# Altium schematic sheet EEM_DIOT_connector.SchDoc: Stabilizer
size 420 x 297 mm; Author: G.Kasprowicz; CompanyName: WUT ISE; DrawnBy: G.Kasprowicz; Organization: WUT ISE; Address1: PW ISE; Address2: Nowowiejska 15/19 00-665 Warsaw; Address3: gkasprow@gmail.com; DocumentNumber: 7; Revision: 1.0; SheetNumber: 7; SheetTotal: 9; ModifiedBy: -; CheckedDate: -; Title2: EEM connector & drivers; DivGrp: WUT ISE; Designer: G.Kasprowicz; ModifiedDate: -; ProjectName: Sensor Box
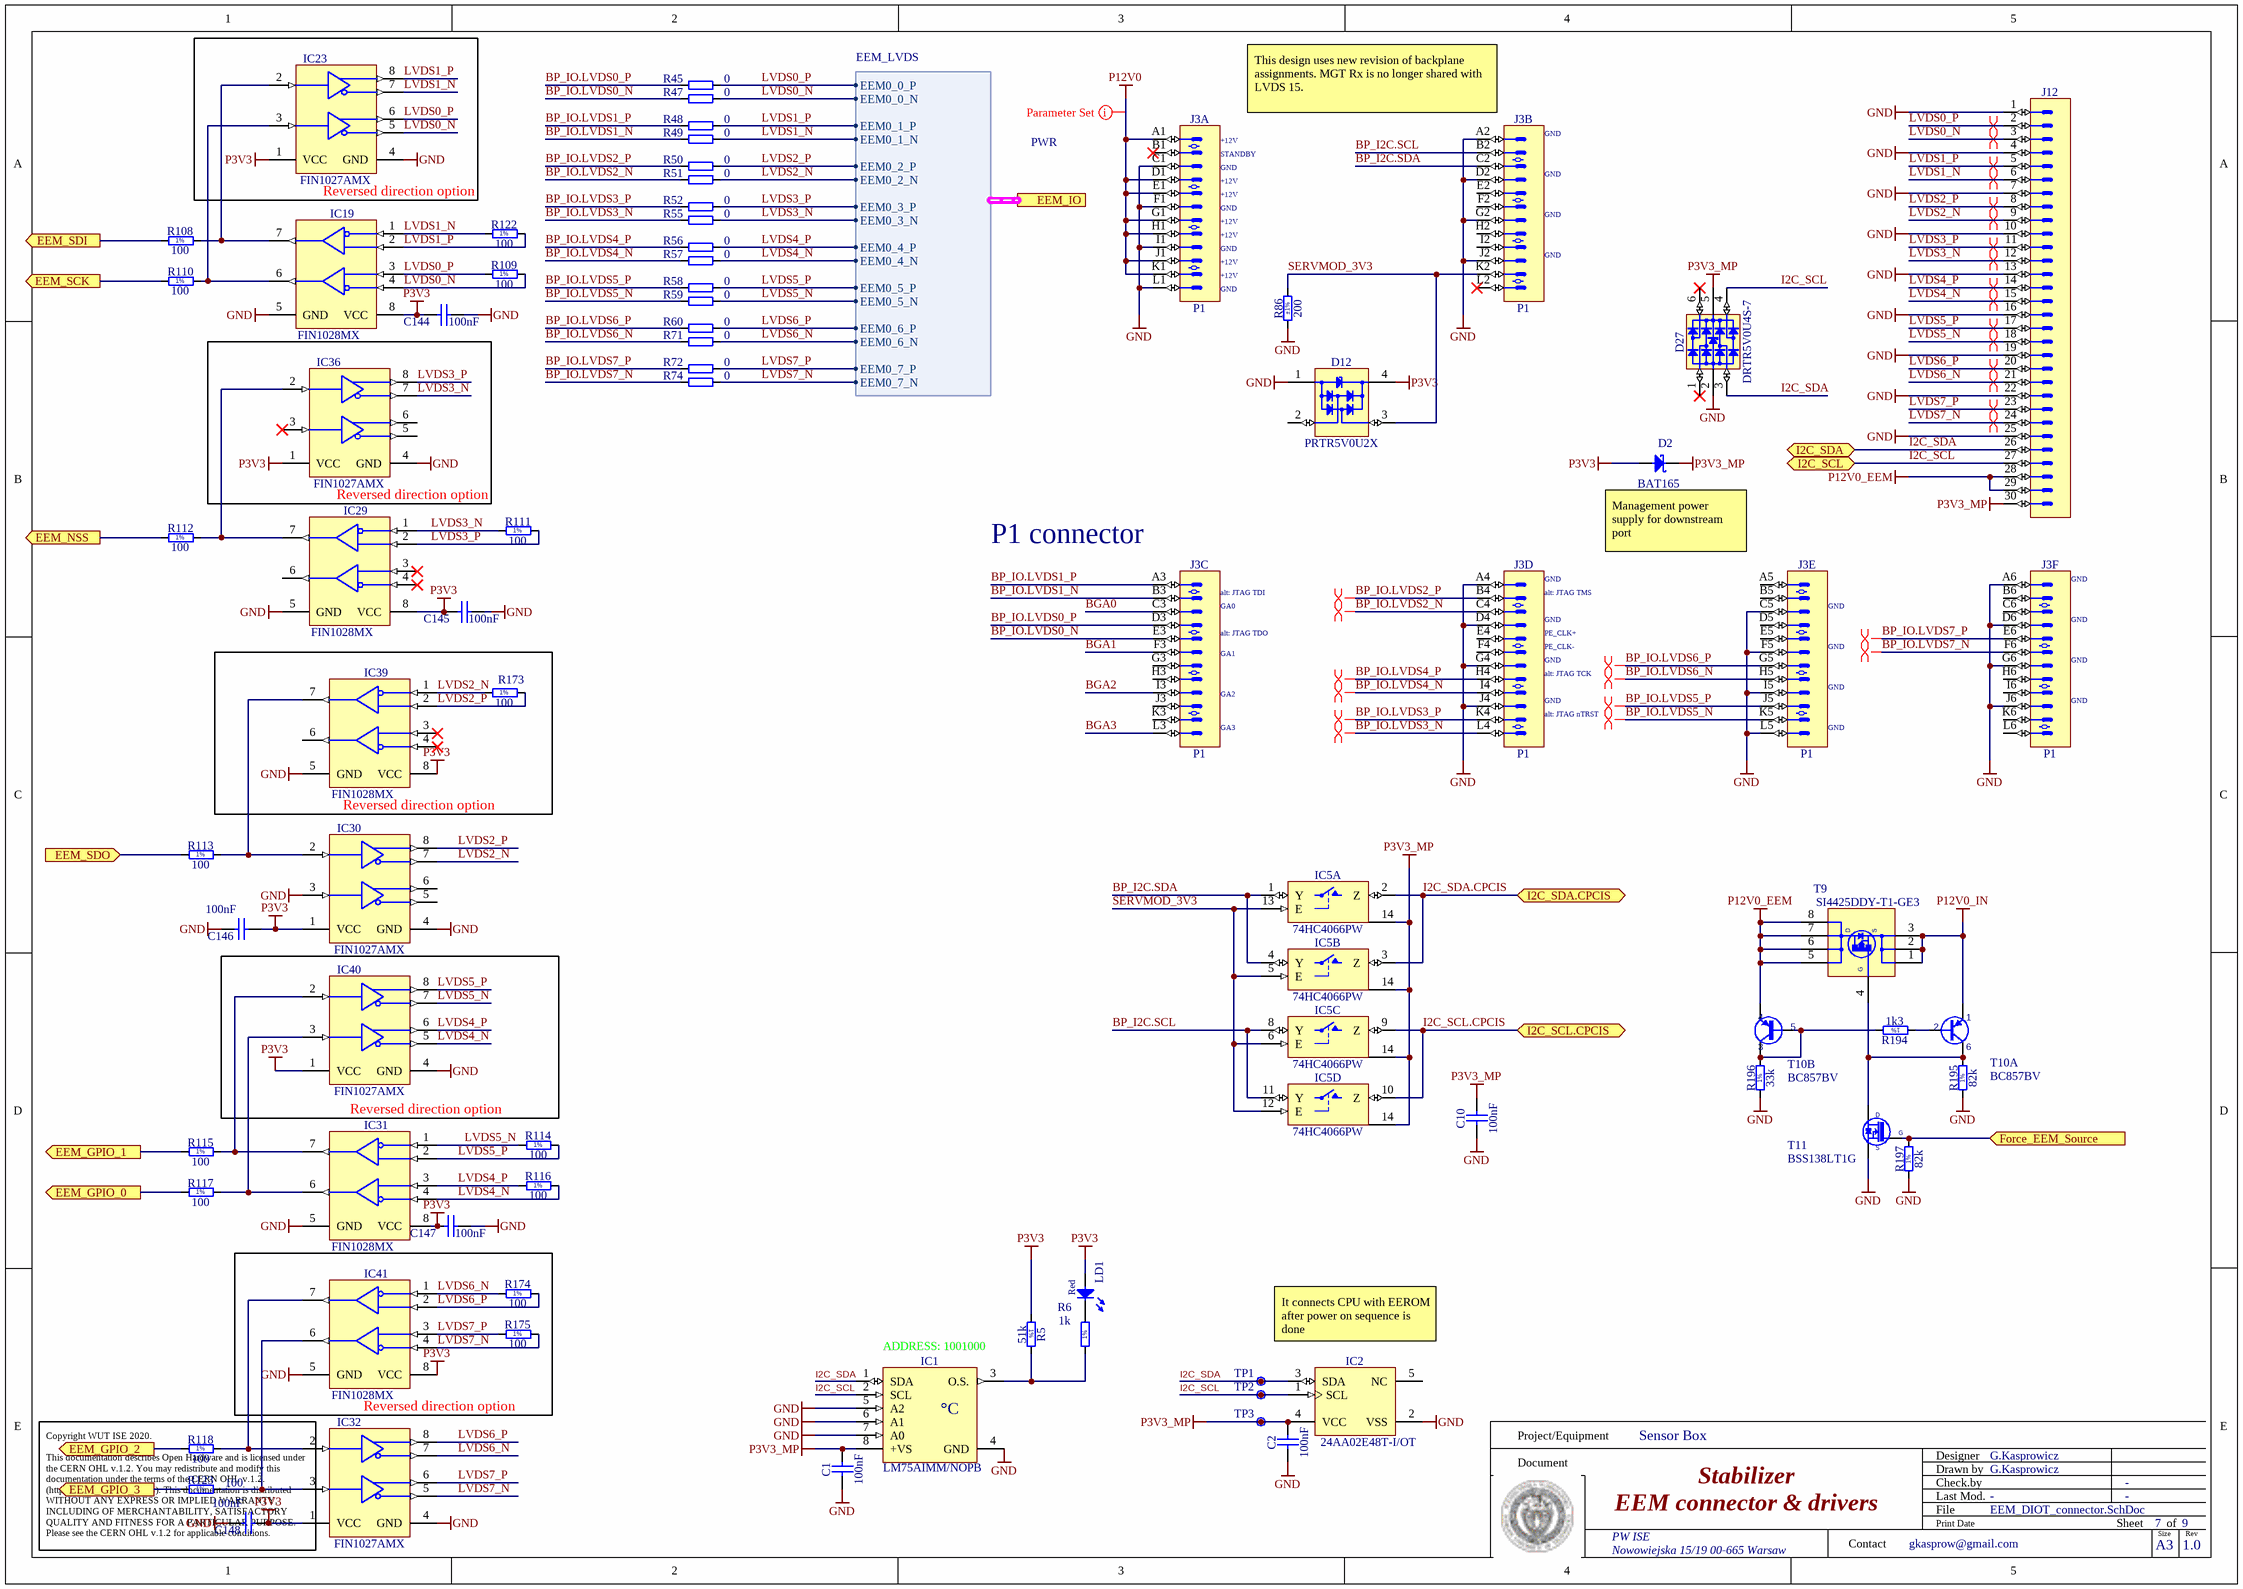
[diagram p0: EEM_DIOT_connector.SchDoc]

## Parts
C1  100nF  [CAPC1005X55N]
C2  100nF  [CAPC1005X55N]
C10  100nF  [CAPC1608X87N]
C144  100nF  [CAPC1005X55N]
C145  100nF  [CAPC1005X55N]
C146  100nF  [CAPC1005X55N]
C147  100nF  [CAPC1005X55N]
C148  100nF  [CAPC1005X55N]
D2  BAT165  [SOD2512X110N]
D12  PRTR5V0U2X  [SOT190P230X110-4N]
D27  DRTR5V0U4S-7  [SOT65P210X110-6N]
IC1  LM75AIMM/NOPB  [SOP65P490X109-8N]
IC2  24AA02E48T-I/OT  [SOT95P280X145-5N]
IC5  74HC4066PW  [SOP65P640X110-14N]  (parts A,B,C,D of 4)
IC19  FIN1028MX  [SOIC127P600X175-8N]
IC23  FIN1027AMX  [SOIC127P600X175-8N]
IC29  FIN1028MX  [SOIC127P600X175-8N]
IC30  FIN1027AMX  [SOIC127P600X175-8N]
IC31  FIN1028MX  [SOIC127P600X175-8N]
IC32  FIN1027AMX  [SOIC127P600X175-8N]
IC36  FIN1027AMX  [SOIC127P600X175-8N]
IC39  FIN1028MX  [SOIC127P600X175-8N]
IC40  FIN1027AMX  [SOIC127P600X175-8N]
IC41  FIN1028MX  [SOIC127P600X175-8N]
J3  P1  [AMPHENOL_10052825-101LF]  (parts A,B,C,D,E,F of 6)
J12  (no value)  [3M_N2530-6002RB]
LD1  Red  [LED_KINGBRIGHT_KPH-1608SURCK]
R5  51k  [RESC1005X40N]
R6  1k  [RESC1005X40N]
R45  0  [RESC1608X55N]
R47  0  [RESC1608X55N]
R48  0  [RESC1608X55N]
R49  0  [RESC1608X55N]
R50  0  [RESC1608X55N]
R51  0  [RESC1608X55N]
R52  0  [RESC1608X55N]
R55  0  [RESC1608X55N]
R56  0  [RESC1608X55N]
R57  0  [RESC1608X55N]
R58  0  [RESC1608X55N]
R59  0  [RESC1608X55N]
R60  0  [RESC1608X55N]
R71  0  [RESC1608X55N]
R72  0  [RESC1608X55N]
R74  0  [RESC1608X55N]
R86  200  Tolerance: ±1%  [RESC1608X55N]
R108  100  [RESC1005X40N]
R109  100  [RESC1005X40N]
R110  100  [RESC1005X40N]
R111  100  [RESC1005X40N]
R112  100  [RESC1005X40N]
R113  100  [RESC1005X40N]
R114  100  [RESC1005X40N]
R115  100  [RESC1005X40N]
R116  100  [RESC1005X40N]
R117  100  [RESC1005X40N]
R118  100  [RESC1005X40N]
R122  100  [RESC1005X40N]
R123  100  [RESC1005X40N]
R173  100  [RESC1005X40N]
R174  100  [RESC1005X40N]
R175  100  [RESC1005X40N]
R194  1k3  [RESC1608X55N]
R195  82k  [RESC1608X55N]
R196  33k  [RESC1005X40N]
R197  82k  [RESC1608X55N]
T9  SI4425DDY-T1-GE3  [SOIC127P600X175-8N]
T10  BC857BV  [SOTFL50P160X60-6N]  (parts A,B of 2)
T11  BSS138LT1G  [SOT95P240X110-3N]
TP1  Test Point  [TPS127]  (value not drawn)
TP2  Test Point  [TPS127]  (value not drawn)
TP3  Test Point  [TPS127]  (value not drawn)

## Blocks framed on the sheet
Reversed direction option: IC23
Reversed direction option: IC36
Reversed direction option: IC39 R173
Reversed direction option: IC40
Reversed direction option: IC41 R174 R175

## Ports
EEM_GPIO_0 (out), EEM_GPIO_1 (out), EEM_GPIO_2 (out), EEM_GPIO_3 (out), EEM_IO (harness EEM_LVDS), EEM_NSS (out), EEM_SCK (out), EEM_SDI (out), EEM_SDO (in), Force_EEM_Source (in), I2C_SCL (bidir), I2C_SCL.CPCIS (bidir), I2C_SDA (bidir), I2C_SDA.CPCIS (bidir)

## Harnesses
EEM_LVDS: EEM0_0_P, EEM0_0_N, EEM0_1_P, EEM0_1_N, EEM0_2_P, EEM0_2_N, EEM0_3_P, EEM0_3_N, EEM0_4_P, EEM0_4_N, EEM0_5_P, EEM0_5_N, EEM0_6_P, EEM0_6_N, EEM0_7_P, EEM0_7_N

## Nets
GND: C1.1 C2.1 C10.1 C144.1 C145.1 C146.1 C147.1 C148.1 D12.1(GND) D27.2(GND) IC1.4(GND) IC1.5(A2) IC1.6(A1) IC1.7(A0) IC2.2(VSS) IC5.7(GND) IC19.5(GND) IC23.4(GND) IC29.5(GND) IC30.3(DIN2RIN-) IC30.4(GND) IC31.5(GND) IC32.4(GND) IC36.4(GND) IC39.5(GND) IC40.4(GND) IC41.5(GND) J3.A2 J3.A4 J3.A6 J3.C1 J3.C5 J3.D2 J3.D4 J3.D6 J3.F1 J3.F5 J3.G2 J3.G4 J3.G6 J3.I1 J3.I5 J3.J2 J3.J4 J3.J6 J3.L1 J3.L5 J12.1 J12.4 J12.7 J12.10 J12.13 J12.16 J12.19 J12.22 J12.25 R86.1 R195.1 R196.1 R197.1 T11.2(S)
P3V3: C144.2 C145.2 C146.2 C147.2 C148.2 D2.2(A) D12.4(VCC) IC19.8(VCC) IC23.1(VCC) IC29.8(VCC) IC30.1(VCC) IC31.8(VCC) IC32.1(VCC) IC36.1(VCC) IC39.8(VCC) IC40.1(VCC) IC41.8(VCC) LD1.2(A) R5.1
P3V3_MP: C1.2 C2.2 C10.2 D2.1(C) D27.5(VBUS) IC1.8(+VS) IC2.4(VCC) IC5.14(VCC) J12.30 TP3.1
P12V0: J3.A1 J3.D1 J3.E1 J3.G1 J3.H1 J3.J1 J3.K1
P12V0_EEM: J12.28 J12.29 T9.5(D) T9.6(D) T9.7(D) T9.8(D) T10.4(E)
P12V0_IN: T9.1(S) T9.2(S) T9.3(S) T10.1(E)
BGA0: J3.C3
BGA1: J3.F3
BGA2: J3.I3
BGA3: J3.L3
BP_I2C.SCL: IC5.8(Y) IC5.11(Y) J3.B2
BP_I2C.SDA: IC5.1(Y) IC5.4(Y) J3.C2
BP_IO.LVDS0_N: J3.E3 R47.1
BP_IO.LVDS0_P: J3.D3 R45.1
BP_IO.LVDS1_N: J3.B3 R49.1
BP_IO.LVDS1_P: J3.A3 R48.1
BP_IO.LVDS2_N: J3.C4 R51.1
BP_IO.LVDS2_P: J3.B4 R50.1
BP_IO.LVDS3_N: J3.L4 R55.1
BP_IO.LVDS3_P: J3.K4 R52.1
BP_IO.LVDS4_N: J3.I4 R57.1
BP_IO.LVDS4_P: J3.H4 R56.1
BP_IO.LVDS5_N: J3.K5 R59.1
BP_IO.LVDS5_P: J3.J5 R58.1
BP_IO.LVDS6_N: J3.H5 R71.1
BP_IO.LVDS6_P: J3.G5 R60.1
BP_IO.LVDS7_N: J3.F6 R74.1
BP_IO.LVDS7_P: J3.E6 R72.1
EEM_GPIO_0: R117.1 ; port EEM_GPIO_0
EEM_GPIO_1: R115.1 ; port EEM_GPIO_1
EEM_GPIO_2: R118.1 ; port EEM_GPIO_2
EEM_GPIO_3: R123.1 ; port EEM_GPIO_3
EEM_NSS: R112.1 ; port EEM_NSS
EEM_SCK: R110.1 ; port EEM_SCK
EEM_SDI: R108.1 ; port EEM_SDI
EEM_SDO: R113.1 ; port EEM_SDO
Force_EEM_Source: R197.2 T11.1(G) ; port Force_EEM_Source
I2C_SCL: D27.4(I/O3) IC1.2(SCL) IC2.1(SCL) J12.27 TP2.1 ; port I2C_SCL
I2C_SCL.CPCIS: IC5.9(Z) IC5.10(Z) ; port I2C_SCL.CPCIS
I2C_SDA: D27.3(I/O2) IC1.1(SDA) IC2.3(SDA) J12.26 TP1.1 ; port I2C_SDA
I2C_SDA.CPCIS: IC5.2(Z) IC5.3(Z) ; port I2C_SDA.CPCIS
LVDS0_N: IC19.4(RIN2-) IC23.5(DOUT-) J12.3 R47.2 R109.2 ; port EEM_IO.EEM0_0_N
LVDS0_P: IC19.3(RIN2+) IC23.6(DOUT+) J12.2 R45.2 R109.1 ; port EEM_IO.EEM0_0_P
LVDS1_N: IC19.1(RIN1-) IC23.7(DOUT-) J12.6 R49.2 R122.1 ; port EEM_IO.EEM0_1_N
LVDS1_P: IC19.2(RIN1+) IC23.8(DOUT+) J12.5 R48.2 R122.2 ; port EEM_IO.EEM0_1_P
LVDS2_N: IC30.7(DOUT-) IC39.1(RIN1-) J12.9 R51.2 R173.1 ; port EEM_IO.EEM0_2_N
LVDS2_P: IC30.8(DOUT+) IC39.2(RIN1+) J12.8 R50.2 R173.2 ; port EEM_IO.EEM0_2_P
LVDS3_N: IC29.1(RIN1-) IC36.7(DOUT-) J12.12 R55.2 R111.1 ; port EEM_IO.EEM0_3_N
LVDS3_P: IC29.2(RIN1+) IC36.8(DOUT+) J12.11 R52.2 R111.2 ; port EEM_IO.EEM0_3_P
LVDS4_N: IC31.4(RIN2-) IC40.5(DOUT-) J12.15 R57.2 R116.2 ; port EEM_IO.EEM0_4_N
LVDS4_P: IC31.3(RIN2+) IC40.6(DOUT+) J12.14 R56.2 R116.1 ; port EEM_IO.EEM0_4_P
LVDS5_N: IC31.1(RIN1-) IC40.7(DOUT-) J12.18 R59.2 R114.1 ; port EEM_IO.EEM0_5_N
LVDS5_P: IC31.2(RIN1+) IC40.8(DOUT+) J12.17 R58.2 R114.2 ; port EEM_IO.EEM0_5_P
LVDS6_N: IC32.7(DOUT-) IC41.1(RIN1-) J12.21 R71.2 R174.1 ; port EEM_IO.EEM0_6_N
LVDS6_P: IC32.8(DOUT+) IC41.2(RIN1+) J12.20 R60.2 R174.2 ; port EEM_IO.EEM0_6_P
LVDS7_N: IC32.5(DOUT-) IC41.4(RIN2-) J12.24 R74.2 R175.2 ; port EEM_IO.EEM0_7_N
LVDS7_P: IC32.6(DOUT+) IC41.3(RIN2+) J12.23 R72.2 R175.1 ; port EEM_IO.EEM0_7_P
SERVMOD_3V3: D12.3(I/O2) IC5.5(E) IC5.6(E) IC5.12(E) IC5.13(E) J3.K2 R86.2
NetIC1_3: IC1.3(O.S.) R5.2 R6.1
NetIC19_6: IC19.6(ROUT2) IC23.3(DIN2RIN-) R110.2
NetIC19_7: IC19.7(ROUT1) IC23.2(DIN1) R108.2
NetIC29_7: IC29.7(ROUT1) IC36.2(DIN1) R112.2
NetIC30_2: IC30.2(DIN1) IC39.7(ROUT1) R113.2
NetIC31_6: IC31.6(ROUT2) IC40.3(DIN2RIN-) R117.2
NetIC31_7: IC31.7(ROUT1) IC40.2(DIN1) R115.2
NetIC32_2: IC32.2(DIN1) IC41.7(ROUT1) R118.2
NetIC32_3: IC32.3(DIN2RIN-) IC41.6(ROUT2) R123.2
NetLD1_1: LD1.1(C) R6.2
NetR194_1: R194.1 T10.2(B)
NetR194_2: R194.2 R196.2 T10.3(C) T10.5(B)
NetR195_2: R195.2 T9.4(S) T10.6(C) T11.3(D)

Not connected (* = marked no-connect by the designer): D12 2(I/O1); D27 1(I/O1)* 6(I/O4)*; IC2 5(NC); IC29 3(RIN2+)* 4(RIN2-)* 6(ROUT2); IC30 5(DOUT-) 6(DOUT+); IC36 3(DIN2RIN-)* 5(DOUT-) 6(DOUT+); IC39 3(RIN2+)* 4(RIN2-)* 6(ROUT2); J3 A5 B1* B5 B6 C6 D5 E2 E4 E5 F2 F4 G3 H2 H3 H6 I2 I6 J3 K3 K6 L2* L6

## Layout directives
differential pair: BP_IO.LVDS2_N, BP_IO.LVDS2_P, BP_IO.LVDS3_N, BP_IO.LVDS3_P, BP_IO.LVDS4_N, BP_IO.LVDS4_P, BP_IO.LVDS5_N, BP_IO.LVDS5_P, BP_IO.LVDS6_N, BP_IO.LVDS6_P, BP_IO.LVDS7_N, BP_IO.LVDS7_P, LVDS0_N, LVDS0_P, LVDS1_N, LVDS1_P, LVDS2_N, LVDS2_P, LVDS3_N, LVDS3_P, LVDS4_N, LVDS4_P, LVDS5_N, LVDS5_P, LVDS6_N, LVDS6_P, LVDS7_N, LVDS7_P
net class PWR: P12V0

## Notes on the sheet
- (near J3) This design uses new revision of backplane assignments. MGT Rx is no longer shared with LVDS 15.
- (near J3) +12V
- (near J3) STANDBY
- (near J3) GND
- +12V
- GND
- (near J3) P1 connector
- (near J3) alt: JTAG TDI
- (near J3) alt: JTAG TMS
- (near D2) Management power supply for downstream port
- (near J3) alt: JTAG TDO
- (near J3) GA1
- (near J3) GA0
- (near J3) PE_CLK+
- (near J3) PE_CLK-
- (near J3) GA2
- (near J3) GA3
- (near J3) alt: JTAG TCK
- (near J3) alt: JTAG nTRST
- It connects CPU with EEROM after power on sequence is done
- (near IC1) ADDRESS: 1001000
- Project/Equipment
- Document
- Designer
- Drawn by
- Check.by
- Copyright WUT ISE 2020.
  This documentation describes Open Hardware and is licensed under the CERN OHL v.1.2. You may redistribute and modify this documentation under the terms of the CERN OHL v.1.2. (http://ohwr.org/CERNOHL). This documentation is distributed WITHOUT ANY EXPRESS OR IMPLIED WARRANTY, INCLUDING OF MERCHANTABILITY, SATISFACTORY QUALITY AND FITNESS FOR A PARTICULAR PURPOSE. Please see the CERN OHL v.1.2 for applicable conditions.
- Contact
- File
- Last Mod.
- Print Date
- Sheet
- Size
- A3
- of
- Rev
- (in symbol LM75AIMM/NOPB) °C
- (in symbol R0402_1K_1%_0.0625W_100PPM) 1%
- (in symbol R0402_33K_1%_0.0625W_100PPM) 1%
- (in symbol R0402_51K_1%_0.0625W_100PPM) 1%
- (in symbol R0402_100R_1%_0.0625W_100PPM) 1%
- (in symbol R0603_1K3_1%_0.1W_100PPM) 1%
- (in symbol R0603_82K_1%_0.1W_100PPM) 1%
- (in symbol SI4425DDY-T1-GE3) G

## Library data of the parts
C1 C2 C144-C148 = CC0402_100NF_16V_10%_X5R: Non-polarised capacitor; Part Description: SMD Multilayer Chip Ceramic Capacitor; Manufacturer: GENERIC; Manufacturer1 Part Number: GRM155R61C104KA88D; Voltage: 16V; TC: X5R; Tolerance: ±10%; Part Number: CC0402_100NF_16V_10%_X5R; Component Kind: Standard; Component Type: Standard; Pin Count: 2; Value: 100nF; Status: None; Manufacturer Part Number: CC0402_100NF_16V_10%_X5R; Case: 0402; Mounted: Yes; Socket: No; SMD: Yes; Sense: No; Manufacturer1 Example: MURATA; Manufacturer1 ComponentHeight: 0.55mm; HelpURL: \\cern.ch\dfs\Applications\Altium\Datasheets\CC0402_X5R_MURATA_GRM.pdf; Author: CERN DEM JLC; CreateDate: 10.12.2013; LatestRevisionDate: 10.12.2013
C10 = CC0603_100NF_50V_10%_X7R: Non-polarised capacitor; Part Description: SMD Multilayer Chip Ceramic Capacitor; Manufacturer: GENERIC; Manufacturer1 Part Number: 223858615649; Voltage: 50V; TC: X7R; Tolerance: ±10%; Part Number: CC0603_100NF_50V_10%_X7R; Component Kind: Standard; Component Type: Standard; Pin Count: 2; Value: 100nF; Status: Preferred; Manufacturer Part Number: CC0603_100NF_50V_10%_X7R; Case: 0603; Mounted: Yes; Socket: No; SMD: Yes; Sense: No; Manufacturer1 Example: PHYCOMP; Manufacturer1 ComponentHeight: 0.87mm; HelpURL: \\cern.ch\dfs\Applications\Altium\Datasheets\CC0603_X7R_PHYCOMP.pdf; Author: CERN DEM JLC; CreateDate: 03.12.2007; LatestRevisionDate: 03.12.2007
D2 = BAT165: Schottky Diode; Part Description: Medium Power AF Schottky Diode; Manufacturer: INFINEON; Voltage: 40V; Power: 750mA; PressFit: No; Bonding: No; Part Number: BAT165; Component Kind: Standard; Component Type: Standard; Device: BAT165; PackageDescription: Small Outline Diode Flat Lead (SOD-323), 1.70mm W X 1.25mm L X 1.10mm H body,  IPC Medium Density; Manufacturer Part Number: BAT165; Pin Count: 2; Case: SOD323; Mounted: Yes; Socket: No; SMD: Yes; Sense: No; ComponentHeight: 1.1mm; HelpURL: \\cern.ch\dfs\Applications\Altium\Datasheets\BAT165.pdf; Author: CERN DEM JLC; CreateDate: 12.11.2014; LatestRevisionDate: 12.11.2014
D12 = PRTR5V0U2X: Ultra Low Capacitance Double Rail-to-Rail ESD Protection Diode; Part Description: Ultra Low Capacitance (1pF) Double Rail-to-Rail ESD Protection Diode (8kV); Manufacturer: NXP SEMICONDUCTORS; Voltage: 5.5V; PressFit: No; Bonding: No; Part Number: PRTR5V0U2X; Component Kind: Standard; Component Type: Standard; Device: PRTR5V0U2X; PackageDescription: SOT143B, SOT, 1.90mm Pitch; 4 Pin, 1.30mm W X 2.90mm L X 1.10mm H body, IPC Medium Density; Manufacturer Part Number: PRTR5V0U2X; Pin Count: 4; Case: SOT143B; Mounted: Yes; Socket: No; SMD: Yes; Sense: No; ComponentHeight: 1.1mm; HelpURL: \\cern.ch\dfs\Applications\Altium\Datasheets\PRTR5V0U2X.pdf; Author: CERN DEM JLC; CreateDate: 22.03.2011; LatestRevisionDate: 22.03.2011
D27 = D_TVS_DRTR5V0U4S-7: Integrated Quad Ultra-Low Capacitance ESD Protection; Part Description: Integrated Quad Ultra-Low Capacitance ESD (±8kV) Protection; Manufacturer: DIODES; PressFit: No; Bonding: No; Status Comment: Active; Part Number: DRTR5V0U4S-7; Component Kind: Standard; Component Type: Standard; Device: DRTR5V0U4S-7; PackageDescription: SOT363, SC70-6, 0.65mm Pitch; 6 Pin, 1.25mm W X 2.00mm L X 1.10mm H body, IPC Medium Density; Status: Active; Manufacturer Part Number: DRTR5V0U4S-7; Pin Count: 6; Case: SOT363; Mounted: Yes; Socket: No; SMD: Yes; Sense: No; ComponentHeight: 1.1mm; HelpURL: \\cern.ch\dfs\Applications\Altium\Datasheets\PRTR5V0U4Y.pdf; Author: GK; CreateDate: 24.01.2017; LatestRevisionDate: 14.09.2020
IC1 = LM75AIMM/NOPB: Digital Temperature Sensor and Thermal Watchdog with Two-Wire Interface; Part Description: -25° to +100°C ±2°C Digital Temperature Sensor and Thermal Watchdog with Two-Wire Interface; Manufacturer: TEXAS INSTRUMENTS; PressFit: No; Bonding: No; Part Number: LM75AIMM/NOPB; Component Kind: Standard; Component Type: Standard; Device: LM75AIMM/NOPB; PackageDescription: SOP, 0.65mm pitch; 8 pin,3.00mm W X 3.00mm L X 1.09mm H bodyI, PC Medium Density; Manufacturer Part Number: LM75AIMM/NOPB; Pin Count: 8; Case: SSOP8; Mounted: Yes; Socket: No; SMD: Yes; Sense: No; ComponentHeight: 1.09mm; HelpURL: \\cern.ch\dfs\Applications\Altium\Datasheets\LM75AIMM-NOPB.pdf; Author: CERN DEM JLC; CreateDate: 15.10.2012; LatestRevisionDate: 15.10.2012
IC2 = 24AA02E48T-I/OT: 1.7V-5.5V, 2K I2C Serial EEPROM With EUI-48 Node Identity; Manufacturer: MICROCHIP TECHNOLOGY; PressFit: No; Bonding: No; Part Number: 24AA02E48T-I/OT; Component Kind: Standard; Component Type: Standard; Device: 24AA02E48T-I/OT; PackageDescription: SOT, 0.95mm pitch; 5 pin, 1.60mm W X 2.90mm L X 1.45mm H body, IPC Medium Density; Part Description: 1.7V-5.5V, 2K I2C Serial EEPROM With EUI-48 Node Identity; Manufacturer Part Number: 24AA02E48T-I/OT; Pin Count: 5; Case: SOT23-5; Mounted: Yes; Socket: No; SMD: Yes; Sense: No; ComponentHeight: 1.45mm; HelpURL: \\cern.ch\dfs\Applications\Altium\Datasheets\24AA02E48T-I-OT.pdf; Author: CERN DEM MR; CreateDate: 31.03.2016; LatestRevisionDate: 31.03.2016
IC5 = 74HC4066PW: Part Description: Quad Single-Pole Single-Throw Analog Switch; Manufacturer: NXP SEMICONDUCTORS; PressFit: No; Bonding: No; Part Number: 74HC4066PW; Component Kind: Standard; Component Type: Standard; Device: 74HC4066PW; PackageDescription: SOP, 14-Leads, Body 4.4x5mm (max), Pitch 0.65mm, IPC Medium Density; Manufacturer Part Number: 74HC4066PW; Pin Count: 14; Case: TSSOP14; Mounted: Yes; Socket: No; SMD: Yes; Sense: No; ComponentHeight: 1.1mm; Author: CERN DEM JLC; HelpURL: \\cern.ch\dfs\Applications\Altium\Datasheets\74HC4066PW.pdf; CreateDate: 19.11.2014; LatestRevisionDate: 19.11.2014
IC19 IC29 IC31 IC39 IC41 = IFC_FIN1028: 3.3V LVDS 2-Bit High-Speed Differential Reciever; Manufacturer: ON Semiconductor; PressFit: No; Bonding: No; Part Number: FIN1028MX; Component Kind: Standard; Component Type: Standard; Device: FIN1028MX; PackageDescription: SOIC 8, Pitch 1.27mm - Body 4x5mm, IPC Medium Density; Part Description: 3.3V LVDS 2-Bit High-Speed Differential Reciever; Manufacturer Part Number: FIN1028MX; Pin Count: 8; Case: SOIC8; Mounted: Yes; Socket: No; SMD: Yes; Sense: No; ComponentHeight: 0.8mm; Author: GK; HelpURL: \\cern.ch\dfs\Applications\Altium\Datasheets\FIN1101K8X.pdf; CreateDate: 08/11/2016; LatestRevisionDate: 08/11/2016
IC23 IC30 IC32 IC36 IC40 = IFC_FIN1027A: 3.3V LVDS, 2-Bit, High-Speed, Differential Driver; Manufacturer: ON Semiconductor; PressFit: No; Bonding: No; Part Number: FIN1027AMX; Component Kind: Standard; Component Type: Standard; Device: FIN1027AMX; PackageDescription: SOIC 8, Pitch 1.27mm - Body 4x5mm, IPC Medium Density; Part Description: 3.3V LVDS, 2-Bit, High-Speed, Differential Driver; Manufacturer Part Number: FIN1027AMX; Pin Count: 8; Case: SOIC8; Mounted: Yes; Socket: No; SMD: Yes; Sense: No; ComponentHeight: 0.8mm; Author: GK; HelpURL: \\cern.ch\dfs\Applications\Altium\Datasheets\FIN1101K8X.pdf; CreateDate: 08/11/2016; LatestRevisionDate: 08/11/2016
J3 = AMPHENOL_10052825-101LF: 72 Contacts Header, 6 Columns, 4 Pairs per Column; Part Description: 72 Contacts, 2mm Pitch, 6 Columns, 4 Pairs per Column, 4 Walls, Right Angle Header; Part Number: AMPHENOL_10052825-101LF; Component Kind: Standard; Component Type: Standard; Pin Count: 72; Family: AirMax VS; Mounted: Yes; Socket: No; SMD: No; PressFit: Yes; Sense: No; Status: None; Manufacturer: AMPHENOL; Manufacturer Part Number: 10052825-101LF; ComponentHeight: 15.35mm; HelpURL: \\cern.ch\dfs\Applications\Altium\Datasheets\AMPHENOL_10052825-101LF.pdf; ComponentLink1URL: \\cern.ch\dfs\Applications\Altium\Datasheets\AMPHENOL_10052825-101LF_Application.pdf; ComponentLink1Description: Application; Author: CERN DEM MR; CreateDate: 19/02/2018; LatestRevisionDate: 19/02/2018; Classname: Overlapping
J12 = 3M_N2530-6002RB: Connector 30 Male; Part Description: 30 Contacts - Straight .100'' x .100'' Low Profile Four-Wall Header, 2500 Series; Manufacturer: 3M; PressFit: No; Part Number: 3M_N2530-6002RB; Component Kind: Standard; Component Type: Standard; Pin Count: 30; Family: Header 30; Mounted: Yes; Socket: No; SMD: No; Sense: No; Status: None; Manufacturer Part Number: N2530-6002RB; ComponentHeight: 10.03mm; HelpURL: \\cern.ch\dfs\Applications\Altium\Datasheets\3M_N2530-6002RB.pdf; Author: CERN DEM JLC; CreateDate: 11.02.2009; LatestRevisionDate: 11.08.2009
LD1 = LED_KINGBRIGHT_KPH-1608SURCK: LED Red 1C 2A; Part Description: SMD Hyper Red LED, Case 1.6mmX0.8mm(0603), 0.65mm Thickness; PressFit: No; Bonding: No; Part Number: LED_KINGBRIGHT_KPH-1608SURCK; Component Kind: Standard; Component Type: Standard; Color: Red; PackageDescription: SMT Hyper Red LED, Case 0603, Body L 1.6 x W 0.8mm H 0.65mm; Manufacturer: KINGBRIGHT; Manufacturer Part Number: KPH-1608SURCK; Pin Count: 2; Mounted: Yes; Socket: No; SMD: Yes; Sense: No; ComponentHeight: 0.65mm; HelpURL: \\cern.ch\dfs\Applications\Altium\Datasheets\LED_KINGBRIGHT_KPH-1608SURCK.pdf; Author: CERN DEM JLC; CreateDate: 03.07.2017; LatestRevisionDate: 03.07.2017
R5 = R0402_51K_1%_0.0625W_100PPM: Resistor - 1%; Part Description: General Purpose Thick Film Chip Resistor; Manufacturer: GENERIC; Manufacturer1 Part Number: 232270674703L; TC: ±100ppm/°C; PressFit: No; Part Number: R0402_51K_1%_0.0625W_100PPM; Component Kind: Standard; Component Type: Standard; Pin Count: 2; Value: 51k; Status: Not Recommended; Power: 0.0625W; Tolerance: ±1%; Manufacturer Part Number: R0402_51K_1%_0.0625W_100PPM; Case: 0402; Mounted: Yes; Sense: No; Socket: No; SMD: Yes; Manufacturer1 Example: YAGEO PHYCOMP; Manufacturer1 ComponentHeight: 0.4mm; HelpURL: \\cern.ch\dfs\Applications\Altium\Datasheets\R0402_Phycomp_RC0402.pdf; Author: CERN DEM JLC; CreateDate: 03.12.2007; LatestRevisionDate: 17.10.2012
R6 = R0402_1K_1%_0.0625W_100PPM: Resistor - 1%; Part Description: General Purpose Thick Film Chip Resistor; Manufacturer: GENERIC; Manufacturer1 Part Number: 232270671002L; TC: ±100ppm/°C; PressFit: No; Part Number: R0402_1K_1%_0.0625W_100PPM; Component Kind: Standard; Component Type: Standard; Pin Count: 2; Value: 1k; Status: Not Recommended; Power: 0.0625W; Tolerance: ±1%; Manufacturer Part Number: R0402_1K_1%_0.0625W_100PPM; Case: 0402; Mounted: Yes; Sense: No; Socket: No; SMD: Yes; Manufacturer1 Example: YAGEO PHYCOMP; Manufacturer1 ComponentHeight: 0.4mm; HelpURL: \\cern.ch\dfs\Applications\Altium\Datasheets\R0402_Phycomp_RC0402.pdf; Author: CERN DEM JLC; CreateDate: 03.12.2007; LatestRevisionDate: 17.10.2012
R45 R47-R52 R55-R60 R71 R72 R74 = R0603_0R_JUMPER: Resistor; Part Description: 1A (0.05R Max DC Resistance) Zero Ohm Jumper; Manufacturer: GENERIC; Manufacturer1 Part Number: NRC06Z0; PressFit: No; Part Number: R0603_0R_JUMPER; Component Kind: Standard; Component Type: Standard; Pin Count: 2; Value: 0; Status: Preferred; Manufacturer Part Number: R0603_0R_JUMPER; Case: 0603; Mounted: Yes; Sense: No; Socket: No; SMD: Yes; Manufacturer1 Example: NIC COMPONENT; Manufacturer1 ComponentHeight: 0.55mm; HelpURL: \\cern.ch\dfs\Applications\Altium\Datasheets\R0603_NIC_NRC.pdf; Author: CERN DEM JLC; CreateDate: 03.12.2007; LatestRevisionDate: 13.03.2008
R86 = R0603_200R_1%_0.1W_100PPM: Resistor - 1%; Part Description: General Purpose Thick Film Chip Resistor; Manufacturer: GENERIC; Manufacturer1 Part Number: NRC06F2000TRF; Power: 0.1W; TC: ±100ppm/°C; PressFit: No; Part Number: R0603_200R_1%_0.1W_100PPM; Component Kind: Standard; Component Type: Standard; Pin Count: 2; Value: 200; Status: Preferred; Manufacturer Part Number: R0603_200R_1%_0.1W_100PPM; Case: 0603; Mounted: Yes; Sense: No; Socket: No; SMD: Yes; Manufacturer1 Example: NIC COMPONENT; Manufacturer1 ComponentHeight: 0.55mm; HelpURL: \\cern.ch\dfs\Applications\Altium\Datasheets\R0603_NIC_NRC.pdf; Author: CERN DEM JLC; CreateDate: 03.12.2007; LatestRevisionDate: 13.03.2008
R108-R118 R122 R123 R173-R175 = R0402_100R_1%_0.0625W_100PPM: Resistor - 1%; Part Description: General Purpose Thick Film Chip Resistor; Manufacturer: GENERIC; Manufacturer1 Part Number: 232270671001L; TC: ±100ppm/°C; PressFit: No; Part Number: R0402_100R_1%_0.0625W_100PPM; Component Kind: Standard; Component Type: Standard; Pin Count: 2; Value: 100; Status: Not Recommended; Power: 0.0625W; Tolerance: ±1%; Manufacturer Part Number: R0402_100R_1%_0.0625W_100PPM; Case: 0402; Mounted: Yes; Sense: No; Socket: No; SMD: Yes; Manufacturer1 Example: YAGEO PHYCOMP; Manufacturer1 ComponentHeight: 0.4mm; HelpURL: \\cern.ch\dfs\Applications\Altium\Datasheets\R0402_Phycomp_RC0402.pdf; Author: CERN DEM JLC; CreateDate: 03.12.2007; LatestRevisionDate: 17.10.2012
R194 = R0603_1K3_1%_0.1W_100PPM: Resistor - 1%; Part Description: General Purpose Thick Film Chip Resistor; Manufacturer: GENERIC; Manufacturer1 Part Number: NRC06F1301TRF; Power: 0.1W; TC: ±100ppm/°C; PressFit: No; Part Number: R0603_1K3_1%_0.1W_100PPM; Component Kind: Standard; Component Type: Standard; Pin Count: 2; Value: 1k3; Status: Preferred; Tolerance: ±1%; Manufacturer Part Number: R0603_1K3_1%_0.1W_100PPM; Case: 0603; Mounted: Yes; Sense: No; Socket: No; SMD: Yes; Manufacturer1 Example: NIC COMPONENT; Manufacturer1 ComponentHeight: 0.55mm; HelpURL: \\cern.ch\dfs\Applications\Altium\Datasheets\R0603_NIC_NRC.pdf; Author: CERN DEM JLC; CreateDate: 03.12.2007; LatestRevisionDate: 13.03.2008
R195 R197 = R0603_82K_1%_0.1W_100PPM: Resistor - 1%; Part Description: General Purpose Thick Film Chip Resistor; Manufacturer: GENERIC; Manufacturer1 Part Number: NRC06F8202TRF; Power: 0.1W; TC: ±100ppm/°C; Part Number: R0603_82K_1%_0.1W_100PPM; Component Kind: Standard; Component Type: Standard; Pin Count: 2; Value: 82k; Status: Preferred; Tolerance: ±1%; Manufacturer Part Number: R0603_82K_1%_0.1W_100PPM; Case: 0603; Mounted: Yes; Sense: No; Socket: No; SMD: Yes; Manufacturer1 Example: NIC COMPONENT; Manufacturer1 ComponentHeight: 0.55mm; HelpURL: \\cern.ch\dfs\Applications\Altium\Datasheets\R0603_NIC_NRC.pdf; Author: CERN DEM JLC; CreateDate: 03.12.2007; LatestRevisionDate: 13.03.2008
R196 = R0402_33K_1%_0.0625W_100PPM: Resistor - 1%; Part Description: General Purpose Thick Film Chip Resistor; Manufacturer: GENERIC; Manufacturer1 Part Number: 232270673303L; TC: ±100ppm/°C; PressFit: No; Part Number: R0402_33K_1%_0.0625W_100PPM; Component Kind: Standard; Component Type: Standard; Pin Count: 2; Value: 33k; Status: Not Recommended; Power: 0.0625W; Tolerance: ±1%; Manufacturer Part Number: R0402_33K_1%_0.0625W_100PPM; Case: 0402; Mounted: Yes; Sense: No; Socket: No; SMD: Yes; Manufacturer1 Example: YAGEO PHYCOMP; Manufacturer1 ComponentHeight: 0.4mm; HelpURL: \\cern.ch\dfs\Applications\Altium\Datasheets\R0402_Phycomp_RC0402.pdf; Author: CERN DEM JLC; CreateDate: 03.12.2007; LatestRevisionDate: 17.10.2012
T9 = SI4425DDY-T1-GE3: -30V -19.7A P-Channel MOSFET; Manufacturer: VISHAY SILICONIX; PressFit: No; Bonding: No; Part Number: SI4425DDY-T1-GE3; Component Kind: Standard; Component Type: Standard; Device: SI4425DDY-T1-GE3; PackageDescription: SOIC 8, Pitch 1.27mm - Body 4x5mm, IPC Medium Density; Part Description: -30V -19.7A P-Channel MOSFET; Manufacturer Part Number: SI4425DDY-T1-GE3; Pin Count: 8; Case: SOIC8; Mounted: Yes; Socket: No; SMD: Yes; Sense: No; ComponentHeight: 1.75mm; HelpURL: \\cern.ch\dfs\Applications\Altium\Datasheets\SI4425DDY-T1-GE3.pdf; Author: CERN DEM MR; CreateDate: 05/10/2016; LatestRevisionDate: 05/10/2016
T10 = BC857BV: 45V, 100mA PNP General Purpose Double Transistor; Part Description: -45V -100mA PNP General Purpose Double Transistor; Manufacturer: NXP SEMICONDUCTORS; PressFit: No; Bonding: No; Part Number: BC857BV; Component Kind: Standard; Component Type: Standard; Device: BC857BV; PackageDescription: SOTFL (SOT666), 0.50mm, Pitch; 6 Pin, 1.20mm W X 1.60mm L X 0.60mm H Body, IPC Medium Density; Manufacturer Part Number: BC857BV; Pin Count: 6; Case: SOT666; Mounted: Yes; Socket: No; SMD: Yes; Sense: No; ComponentHeight: 0.6mm; HelpURL: \\cern.ch\dfs\Applications\Altium\Datasheets\BC857BV.pdf; Author: CERN DEM JLC; CreateDate: 01/12/2011; LatestRevisionDate: 01/12/2011
T11 = BSS138LT1G: N-CHANNEL MOSFET WITH DIODE; Part Description: 50V 200mA N-Channel Enhancement Mode Field-Effect Transistor; Manufacturer: ON SEMICONDUCTOR; PressFit: No; Bonding: No; Part Number: BSS138LT1G; Component Kind: Standard; Component Type: Standard; Device: BSS138LT1G; PackageDescription: SOT23 3-Leads, Pitch 0.95mm - Body 1.4x3mm, IPC Medium Density; Manufacturer Part Number: BSS138LT1G; Pin Count: 3; Case: SOT23-3; Mounted: Yes; Socket: No; SMD: Yes; Sense: No; ComponentHeight: 1.11mm; HelpURL: \\cern.ch\dfs\Applications\Altium\Datasheets\BSS138LT1G.pdf; Author: CERN DEM JLC; CreateDate: 23.03.2009; LatestRevisionDate: 23.03.2009
TP1-TP3 = SMD_PAD_1.27X1.27MM: Part Description: 1.27mm x 1.27mm PCB Copper Area (SMD Test Point); Mounted: No; Part Number: SMD_PAD_1.27X1.27MM; Component Kind: Standard (No BOM); Component Type: Standard (No BOM); Pin Count: 1; Family: Test Point; Socket: No; SMD: Yes; Sense: No; Status: None; ComponentHeight: 0mm; HelpURL: Undefined; Author: CERN DEM JLC; CreateDate: 12.01.2008; LatestRevisionDate: 12.01.2008; PackageDescription: 1.27mm x 1.27mm PCB Copper Area (SMD Test Point)